# EAGLE schematic valhalla_v0.1 (EAGLE 6.5.0)
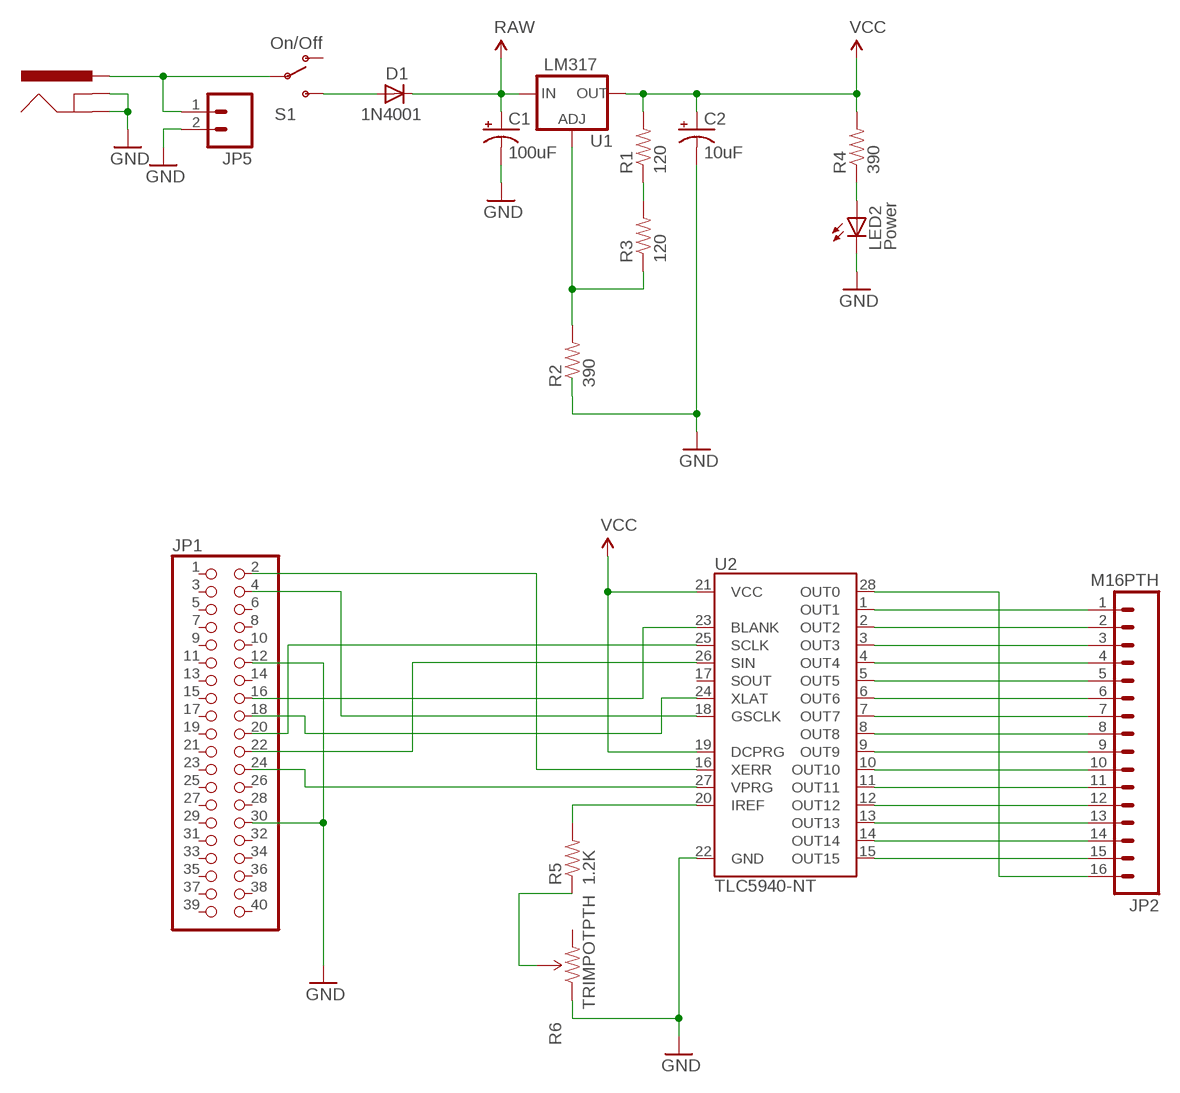
[diagram p0: schematic, sheet 1]

## Parts
C1  100uF  CAP_POLPTH1  [CPOL-RADIAL-100UF-25V]
C2  10uF  CAP_POLPTH2  [CPOL-RADIAL-10UF-25V]
D1  1N4001  DIODEPTH  [DIODE-0.4]
J1  POWER_JACKPTH  [POWER_JACK_PTH]
JP1  PINHD-2X20  [2X20]
JP2  M16PTH  [1X16]
JP5  M02PTH  [1X02]
LED2  Power  LED5MM  [LED5MM]
R1  120  RESISTORPTH1  [AXIAL-0.3]
R2  390  RESISTORPTH1  [AXIAL-0.3]
R3  120  RESISTORPTH1  [AXIAL-0.3]
R4  390  RESISTORPTH1  [AXIAL-0.3]
R5  1.2K  RESISTORPTH-1/2W  [AXIAL-0.5]
R6  TRIMPOTPTH  [TRIM_POT_PTH]
S1  On/Off  SWITCH-SPSTPTH  [SWITCH-SPST]
U1  LM317  V_REG_317SINK  [TO220-ADJ]
U2  TLC5940-NT  [DIL28-3]

## Nets
BLANK: JP1.16 U2.23(BLANK)
GND: C1.2(-) C2.2(-) J1.GND J1.GNDBREAK JP1.12 JP1.30 JP5.2 LED2.K(C) R2.P$1 R6.1(CCW) U2.22(GND)
GSCLK: JP1.4 U2.18(GSCLK)
IREF: R5.P$2 U2.20(IREF)
N$1: JP2.1 U2.1(OUT1)
N$2: D1.A S1.3(S)
N$3: J1.PWR JP5.1 S1.2(P)
N$4: JP2.2 U2.2(OUT2)
N$5: R5.P$1 R6.2(WIPER)
N$6: JP2.3 U2.3(OUT3)
N$7: JP2.4 U2.4(OUT4)
N$8: LED2.A R4.P$1
N$9: JP2.5 U2.5(OUT5)
N$10: JP2.6 U2.6(OUT6)
N$11: JP2.7 U2.7(OUT7)
N$12: JP2.8 U2.8(OUT8)
N$13: JP2.9 U2.9(OUT9)
N$14: JP2.10 U2.10(OUT10)
N$15: JP2.11 U2.11(OUT11)
N$16: JP2.12 U2.12(OUT12)
N$17: JP2.13 U2.13(OUT13)
N$18: JP2.14 U2.14(OUT14)
N$19: JP2.15 U2.15(OUT15)
N$20: JP2.16 U2.28(OUT0)
N$22: R1.P$1 R3.P$2
N$24: R2.P$2 R3.P$1 U1.ADJ
RAW: C1.1(+) D1.C U1.IN
SCLK: JP1.20 U2.25(SCLK)
SIN: JP1.22 U2.26(SIN)
VCC: C2.1(+) R1.P$2 R4.P$2 U1.OUT U2.19(DCPRG) U2.21(VCC)
VPRG: JP1.24 U2.27(VPRG)
XERR: JP1.2 U2.16(XERR)
XLAT: JP1.18 U2.24(XLAT)
Unconnected: JP1.1 JP1.3 JP1.5 JP1.6 JP1.7 JP1.8 JP1.9 JP1.10 JP1.11 JP1.13 JP1.14 JP1.15 JP1.17 JP1.19 JP1.21 JP1.23 JP1.25 JP1.26 JP1.27 JP1.28 JP1.29 JP1.31 JP1.32 JP1.33 JP1.34 JP1.35 JP1.36 JP1.37 JP1.38 JP1.39 JP1.40 R6.3(CW) S1.1(O) U2.17(SOUT)

## Library data of the parts
C1 C2 = SparkFun:CAP_POL: Capacitor Polarized These are standard SMD and PTH capacitors. Normally 10uF, 47uF, and 100uF in electrolytic and tantalum varieties. Always verify the external diameter of the through hole cap, it varies with capacity, voltage, and manufacturer. The EIA devices should be standard.
D1 = SparkFun:DIODE: Diode These are standard reverse protection diodes and small signal diodes. SMA package can handle up to about 1A. SOD-323 can handle about 200mA. What the SOD-323 package when ordering, there are some mfgs out there that are 5-pin packages.
J1 = SparkFun:POWER_JACK: Power Jack This is the standard 5.5mm barrel jack for power. The PTH is the most common, proven, reliable, footprint. All others are experimental. The Slot footprint only works if the mill layer is transmitted to the PCB fab house so be warned. Spark Fun Electronics SKU : PRT-00119. Mating wall wart : TOL-00298 (and others)
JP1 = adafruit:PINHD-2X20: PIN HEADER
JP2 = SparkFun-Connectors:M16: 1x16 .1" header
JP5 = SparkFun:M02: Header 2 Standard 2-pin 0.1" header. Use with straight break away headers (SKU : PRT-00116), right angle break away headers (PRT-00553), swiss pins (PRT-00743), machine pins (PRT-00117), and female headers (PRT-00115). Molex polarized connector foot print use with SKU : PRT-08233 with associated crimp pins and housings.
LED2 = SparkFun-Nate:LED
R1-R4 = SparkFun:RESISTOR: Resistor
R5 = SparkFun-Resistors:RESISTOR: Resistor
R6 = SparkFun-Electromechanical:TRIMPOT: Various small potentiometers for "set-and-forget" applications
S1 = SparkFun:SWITCH-SPST: SPST Switch Simple slide switch. Spark Fun Electronics SKU : COM-00102
U1 = SparkFun:V_REG_317: Voltage Regulator Standard LM317 adjustable voltage regulator. AOI (Adjust Output Input). Google 'LM317 Calculator' for easy to use app to get the two resistor values needed. 240/720 for 5V output. 240/390 for 3.3V output. Spark Fun Electronics SKU : COM-00527
U2 = SparkFun-DigitalIC:TLC5940: 16-channel LED Driver with Dot Correction and Grayscale PWM Control The TLC5940 is a 16-channel, constant-current sink LED driver. Each channel has an individually adjustable 4096-step grayscale PWM brightness control and a 64-step, constant-current sink (dot correction). The dot correction adjusts the brightness variations between LED channels and other LED drivers. The dot correction data is stored in an integrated EEPROM. Both grayscale control and dot correction are accessible via a serial interface. A single external resistor sets the maximum current value of all 16 channels. Packages: 28-pin HTSSOP 32-pin 5x5mm QFN 28-pin DIP

## Net classes
0 default: width 0.254 mm